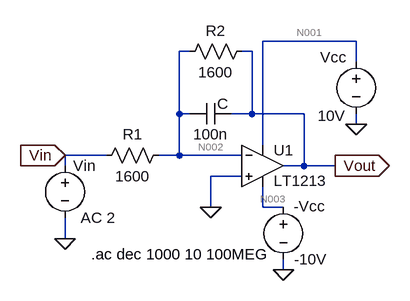
[diagram p0: schematic ES5.asc]
ES5.asc, the LTspice schematic file:
Version 4
SHEET 1 880 680
WIRE 352 -32 208 -32
WIRE 96 -16 80 -16
WIRE 192 -16 176 -16
WIRE 352 0 352 -32
WIRE 80 80 80 -16
WIRE 96 80 80 80
WIRE 192 80 192 -16
WIRE 192 80 160 80
WIRE 272 80 192 80
WIRE 352 96 352 80
WIRE 208 128 208 -32
WIRE -32 144 -96 144
WIRE 80 144 80 80
WIRE 80 144 48 144
WIRE 176 144 80 144
WIRE -96 160 -96 144
WIRE 272 160 272 80
WIRE 272 160 240 160
WIRE 320 160 272 160
WIRE 176 176 128 176
WIRE 128 224 128 176
WIRE 208 224 208 192
WIRE 240 224 208 224
WIRE -96 272 -96 240
WIRE 240 320 240 304
FLAG 240 320 0
FLAG 320 160 Vout
IOPIN 320 160 Out
FLAG 128 224 0
FLAG -96 272 0
FLAG 352 96 0
FLAG -96 144 Vin
IOPIN -96 144 In
SYMBOL OpAmps\\LT1213 208 96 R0
WINDOW 0 17 40 Left 2
WINDOW 3 17 87 Left 2
SYMATTR InstName U1
SYMBOL voltage 352 -16 R0
WINDOW 0 -55 9 Left 2
WINDOW 3 -59 99 Left 2
SYMATTR InstName Vcc
SYMATTR Value 10V
SYMBOL voltage 240 208 R0
WINDOW 0 16 14 Left 2
WINDOW 3 17 96 Left 2
SYMATTR InstName -Vcc
SYMATTR Value -10V
SYMBOL res 64 128 R90
WINDOW 0 -1 56 VBottom 2
WINDOW 3 32 56 VTop 2
SYMATTR InstName R1
SYMATTR Value 1600
SYMBOL voltage -96 144 R0
WINDOW 123 0 0 Left 0
WINDOW 39 0 0 Left 0
WINDOW 0 13 16 Left 2
SYMATTR InstName Vin
SYMATTR Value AC 2
SYMBOL cap 160 64 R90
WINDOW 0 16 13 VBottom 2
WINDOW 3 32 32 VTop 2
SYMATTR InstName C
SYMATTR Value 100n
SYMBOL res 192 -32 R90
WINDOW 0 0 56 VBottom 2
WINDOW 3 32 56 VTop 2
SYMATTR InstName R2
SYMATTR Value 1600
TEXT -56 296 Left 2 !.ac dec 1000 10 100MEG

The netlist it stands for:
* ES5.asc
XU1 0 N002 N001 N003 Vout LT1213  ; pins In+ In- V+ V- OUT
Vcc N001 0 10V
V§-Vcc N003 0 -10V
R1 N002 Vin 1600
Vin Vin 0 AC 2
C Vout N002 100n
R2 Vout N002 1600
.ac dec 1000 10 100MEG
.lib LTC.lib
.backanno
.end

* Results of the author's LTspice run, read from the files saved beside the schematic
* Operating Point, zero values left out:
*   V(n001) = 10 V
*   V(vout) = -128 µV
*   V(n003) = -10 V
*   I(R2) = -80 nA
*   I(-vcc) = 2.7 mA
*   I(Vcc) = -2.7 mA
*   Ix(u1:1) = -80 nA
*   Ix(u1:2) = -80 nA
*   Ix(u1:3) = 2.7 mA
*   Ix(u1:4) = -2.7 mA
*   Ix(u1:5) = 80 nA
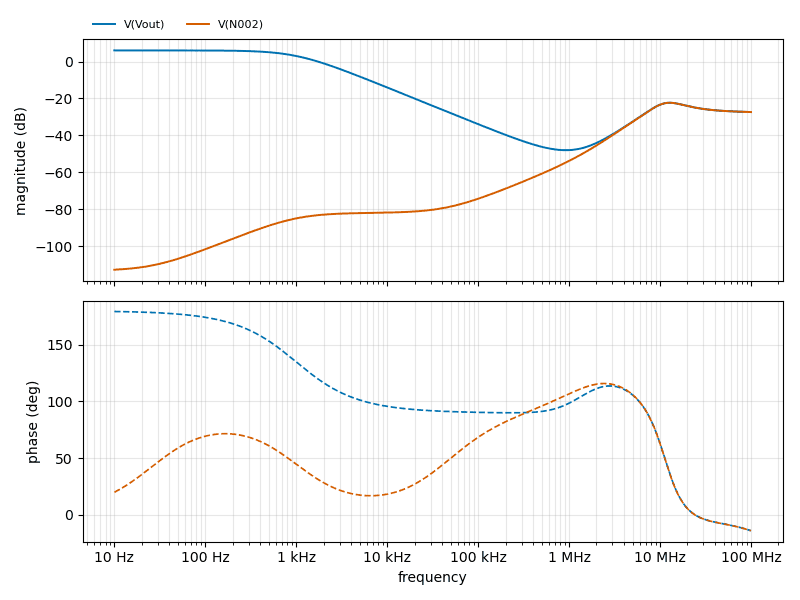
[diagram p1: AC Analysis of ES5.asc, plotted from the saved traces]
* AC Analysis, 1 run:
*   V(Vout): 6.02 dB at 10 Hz, -27.39 dB at 100 MHz, peak 6.02 dB at 10 Hz, 3 dB below the peak at 994.8 Hz
*   V(N002): -112.80 dB at 10 Hz, -27.39 dB at 100 MHz, peak -22.35 dB at 12.74 MHz, 3 dB below the peak at 8.385 MHz and 26.93 MHz